# Altium project Cellar Watchdog.PrjPcb (part 2 of 4)

## Sheet CPU Clock.SchDoc: CPU Clock
size A4; Date: Dec. 27th, 2022; Author: Karl Asseily; DrawnBy: Karl Asseily; DocumentNumber: 202301222126; Revision: 1.2; SheetNumber: 12; SheetTotal: 20
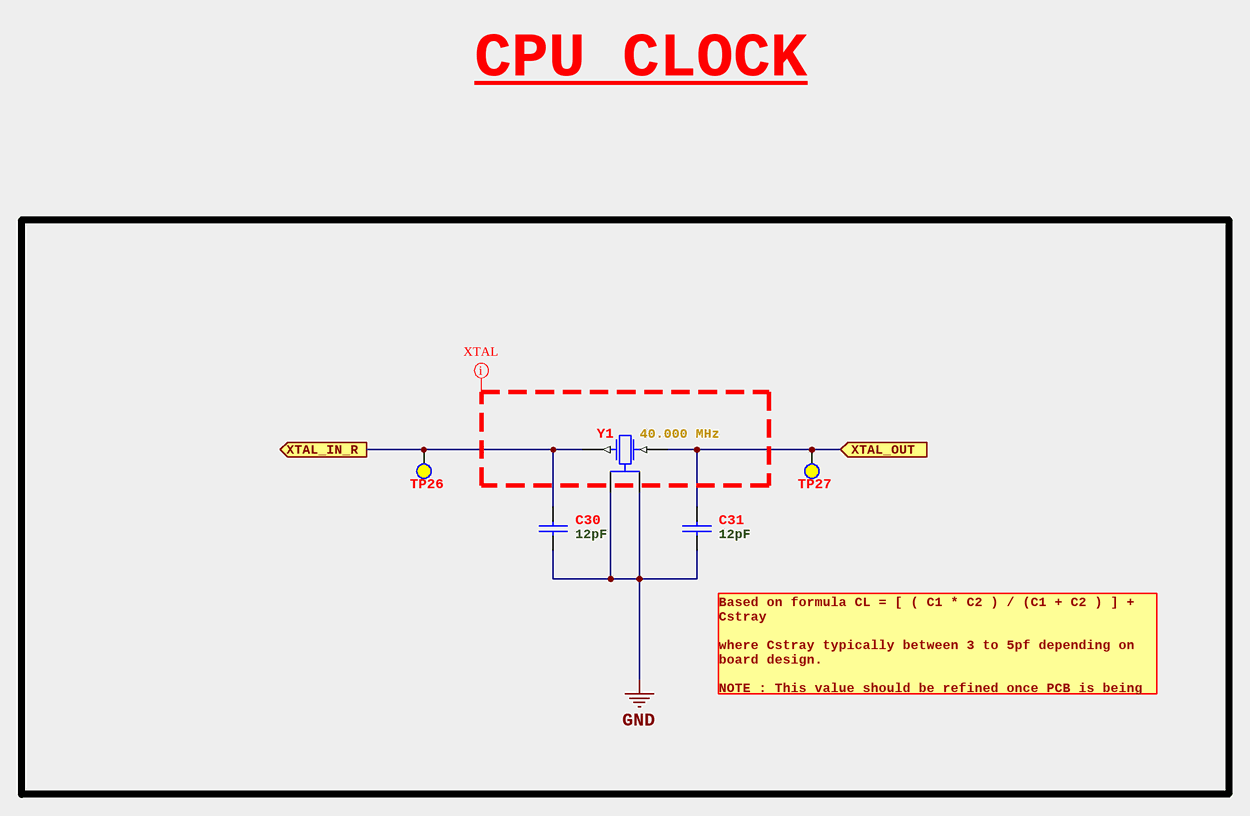
[diagram p6: CPU Clock.SchDoc]

### Parts
C30  12pF  [CAP_0603]
C31  12pF  [CAP_0603]
TP26  CPU 40MHz IN  [TEST POINT HOLE]  (value not drawn)  (no BOM)
TP27  CPU 40MHz OUT  [TEST POINT HOLE]  (value not drawn)  (no BOM)
Y1  Frequency: 40.000 MHz  [XTAL_ECS-400-10-37B2]  (hidden comment: ECS-400-10-37B2-CKY-TR)

### Ports
XTAL_IN_R (out, see Main Controller Unit, ESP32 Processor), XTAL_OUT (in, see Main Controller Unit, ESP32 Processor)

### Nets
GND: C30.2 C31.2 Y1.2(GND) Y1.4(GND)
XTAL_IN_R: C30.1 TP26.TP Y1.1(In/Out) ; port XTAL_IN_R
XTAL_OUT: C31.1 TP27.TP Y1.3(Out/In) ; port XTAL_OUT

### Layout directives
net class XTAL; rule Maximum Via Count Constraint [Max Count = 0]: (no net found under the mark)

### Notes on the sheet
- CPU CLOCK
- Based on formula CL = [ ( C1 * C2 ) / (C1 + C2 ) ] + Cstray
  where Cstray typically between 3 to 5pf depending on board design.
  NOTE : This value should be refined once PCB is being designed
- Project
- Sheet
- Size
- Filename
- A4
- of
- Number
- Drawn By
- Rev.
- Variant
- Date

### Library data of the parts
C30 C31 = CAP_12pf-50V-5%_0603: 12 pF ±5% 50V Ceramic Capacitor C0G, NP0 0603 (1608 Metric); Manufacturer: Yageo; Manufacturer Part Number: CC0603JRNPO9BN120; Insulation Resistance: 100GR; Supplier 1: Digi-Key; RoHS: Yes; Category: Ceramic Capacitors; Stock 1: 152407; Pricing 1: 1=0.10000, 10=0.05100, 50=0.02800, 100=0.02280, 500=0.01630, 1000=0.01280 (USD); Mounting Technology: Surface Mount; Case/Package: 0603; Pins: 2; Case Code (Metric): 1608; Case Code (Imperial): 0603; Dielectric Material: Ceramic; Min Operating Temperature: -55°C; Max Operating Temperature: 125°C; Package Quantity: 1; Capacitance: 12pF; Voltage Rating: 50V; Tolerance: 5%; Packaging: Tape and Reel; Voltage Rating (DC): 50V; Dielectric: C0G; Termination: SMD/SMT; Resistor Type: Ceramic; Series: CC; Length: 1.6mm; Width: 0.031inch; Height: 0.8mm; Thickness: 0.035inch; Depth: 0.8mm; Radiation Hardening: No; Reach SVHC Compliant: Yes; Lead Free: Lead Free; RoHS Compliant: Yes; ComponentLink7URL: C:\Users\Public\Documents\Altium\Projects\Cellar_Watchdog\Docs\Capacitor\UPY-GP_NP0_16V-to-50V_18.pdf; ComponentLink7Description: Datasheet; Supplier 2: Mouser; Supplier Part Number 1: 311-1059-1-ND; Supplier Part Number 2: 603-CC603JRNPO9BN120
TP26 TP27 = Test Point: PCB Test Point; ClassName: Test Point
  TP26: Value: CPU 40MHz IN
  TP27: Value: CPU 40MHz OUT
Y1 = XTAL_40.000MHz-10pF_4-SMD: 40 MHz ±10ppm Crystal 10pF 40 Ohms 4-SMD, No Lead; Manufacturer: ECS International; Supplier 1: Digi-Key; Manufacturer Part Number: ECS-400-10-37B2-CKY-TR; RoHS: No; Category: Uncategorized; Stock 1: 33639; Pricing 1: 1=0.45000, 10=0.37900, 50=0.34080, 100=0.30300, 500=0.28784, 1000=0.24240 (USD); Supplier 2: Mouser; Supplier Part Number 2: 520-400-10-37B2CKYTR; Supplier Part Number 1: 50-ECS-400-10-37B2-CKY-TRCT-ND; ComponentLink1Description: Datasheet; ComponentLink1URL: C:\Users\Public\Documents\Altium\Projects\Cellar_Watchdog\Docs\Crystal\ECX-1637B2.pdf

## Sheet RTC Clock.SchDoc: RTC Clock
size A4; Date: Dec. 27th, 2022; Author: Karl Asseily; DrawnBy: Karl Asseily; DocumentNumber: 202301140903; Revision: 1.2; SheetNumber: 16; SheetTotal: 20
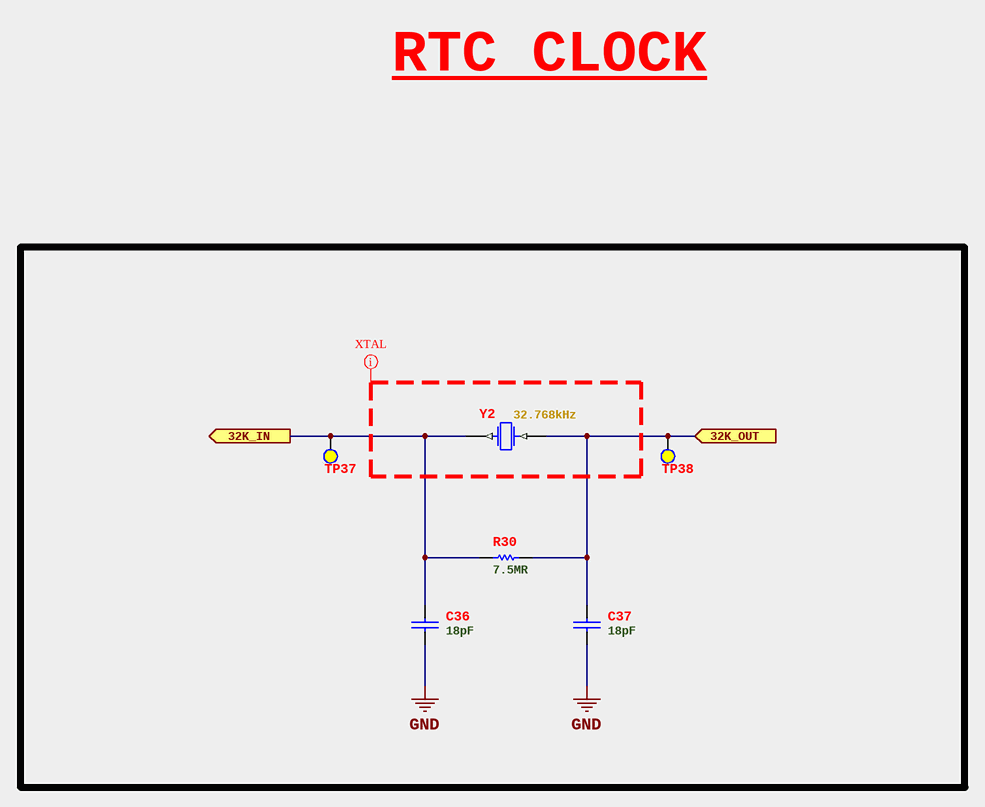
[diagram p7: RTC Clock.SchDoc]

### Parts
C36  18pF  [CAP_0603]
C37  18pF  [CAP_0603]
R30  7.5MR  [RES_0603]
TP37  RTC 32.768KHz IN  [TEST POINT HOLE]  (value not drawn)  (no BOM)
TP38  RTC 32.768KHz OUT  [TEST POINT HOLE]  (value not drawn)  (no BOM)
Y2  Frequency: 32.768kHz  [XTAL_ECX-.327-CDX-1293]  (hidden comment: ECX-.327-CDX-1293)

### Ports
32K_IN (out, see Main Controller Unit, ESP32 Processor), 32K_OUT (in, see Main Controller Unit, ESP32 Processor)

### Nets
GND: C36.2 C37.2
32K_IN: C36.1 R30.1 TP37.TP Y2.1(In/Out) ; port 32K_IN
32K_OUT: C37.1 R30.2 TP38.TP Y2.2(Out/In) ; port 32K_OUT

### Layout directives
net class XTAL; rule Maximum Via Count Constraint [Max Count = 0]: (no net found under the mark)

### Notes on the sheet
- RTC CLOCK
- Project
- Sheet
- Size
- Filename
- A4
- of
- Number
- Drawn By
- Rev.
- Variant
- Date

### Library data of the parts
C36 C37 = CAP_18pf-50V-1%_0603: 18 pF ±1% 50V Ceramic Capacitor C0G, NP0 0603 (1608 Metric); Manufacturer: Yageo; Manufacturer Part Number: CC0603FRNPO9BN180; Supplier 1: Digi-Key; RoHS: Yes; Category: Ceramic Capacitors; Stock 1: 77143; Pricing 1: 1=0.19000, 10=0.13300, 50=0.07560, 100=0.06260, 500=0.04390, 1000=0.03634 (USD); Mounting Technology: Surface Mount; Case/Package: 0603; Case Code (Imperial): 0603; Case Code (Metric): 1608; Min Operating Temperature: -55°C; Max Operating Temperature: 125°C; Tolerance: 1%; Capacitance: 18pF; Dielectric: C0G; Packaging: Tape and Reel; Voltage Rating: 50V; Voltage Rating (DC): 50V; Termination: SMD/SMT; Resistor Type: Ceramic; Series: CC; Length: 1.6mm; Width: 0.031inch; Height: 0.8mm; Thickness: 0.035inch; Depth: 0.8mm; Radiation Hardening: No; Lead Free: Lead Free; RoHS Compliant: Yes; Supplier 2: Mouser; ComponentLink1Description: Datasheet; ComponentLink1URL: C:\Users\Public\Documents\Altium\Projects\Cellar_Watchdog\Docs\Capacitor\UPY-GP_NP0_16V-to-50V_18.pdf; Supplier Part Number 2: 603-CC603FRNPO9BN180; Supplier Part Number 1: 311-3889-1-ND
R30 = RES_7.5MR-100mW-1%_0603: 7.5 MOhms ±1% 0.1W, 1/10W Chip Resistor 0603 (1608 Metric) Moisture Resistant Thick Film; Manufacturer: Yageo; Manufacturer Part Number: RC0603FR-077M5L; Temperature Coefficient: 100ppm/°C; Power Rating: 100mW; Voltage Rating: 50V; Supplier 1: Digi-Key; RoHS: Yes; Category: Chip SMD Resistors; Stock 1: 22856; Pricing 1: 1=0.10000, 10=0.02100, 100=0.00850, 1000=0.00383, 2500=0.00332 (USD); Case/Package: 0603; Contact Plating: Tin,Matte; Case Code (Imperial): 0603; Case Code (Metric): 1608; Min Operating Temperature: -55°C; Max Operating Temperature: 155°C; Resistance: 7.5MR; Tolerance: 1%; Resistor Type: Thick Film; Packaging: Tape and Reel; Termination: SMD/SMT; Number of Terminations: 2; Max Power Dissipation: 100mW; Features: Moisture Resistant; Series: RC; Construction: Rectangular; Length: 1.6mm; Width: 0.8mm; Height: 0.022inch; Depth: 0.8mm; Military Standard: Not; Lead Free: Lead Free; RoHS Compliant: Yes; ComponentLink1URL: C:\Users\Public\Documents\Altium\Projects\Cellar_Watchdog\Docs\Resistor\PYu-RC_Group_51_RoHS_L_12.pdf; ComponentLink1Description: Datasheet; Supplier 2: Mouser; Supplier Part Number 2: 603-RC0603FR-077M5L; Supplier Part Number 1: 13-RC0603FR-077M5LCT-ND
TP37 TP38 = Test Point: PCB Test Point; ClassName: Test Point
  TP37: Value: RTC 32.768KHz IN
  TP38: Value: RTC 32.768KHz OUT
Y2 = XTAL_32.768KHz-12.5pF_2-SMD: 32.768 kHz ±5ppm Crystal 12.5pF 70 kOhms 2-SMD, No Lead; Manufacturer: ECS International; ESR (Equivalent Series Resistance): 70kR; Supplier 1: Digi-Key; Manufacturer Part Number: ECX-.327-CDX-1293; RoHS: Yes; Category: Crystals; Stock 1: 208118; Pricing 1: 1=0.81000, 10=0.72000, 50=0.67320, 100=0.59490, 500=0.56358, 1000=0.46965 (USD); Mount: Surface Mount; Case/Package: SMD/SMT; Min Operating Temperature: -40°C; Max Operating Temperature: 85°C; Packaging: Tape and Reel; Frequency Tolerance: 5ppm; Load Capacitance: 12.5pF; RoHS Compliant: Yes; ComponentLink1URL: C:\Users\Public\Documents\Altium\Projects\Cellar_Watchdog\Docs\Crystal\ECX-.327-CDX-1293.pdf; ComponentLink1Description: Datasheet; Supplier 2: Mouser; Supplier Part Number 2: 520-ECX-.327CDX-1293; Supplier Part Number 1: XC2292CT-ND

## Sheet Voltage Supervisor.SchDoc: Voltage Supervisor
size A4; Date: Dec. 27th, 2022; Author: Karl Asseily; DrawnBy: Karl Asseily; DocumentNumber: 202301140903; Revision: 1.2; SheetNumber: 14; SheetTotal: 20
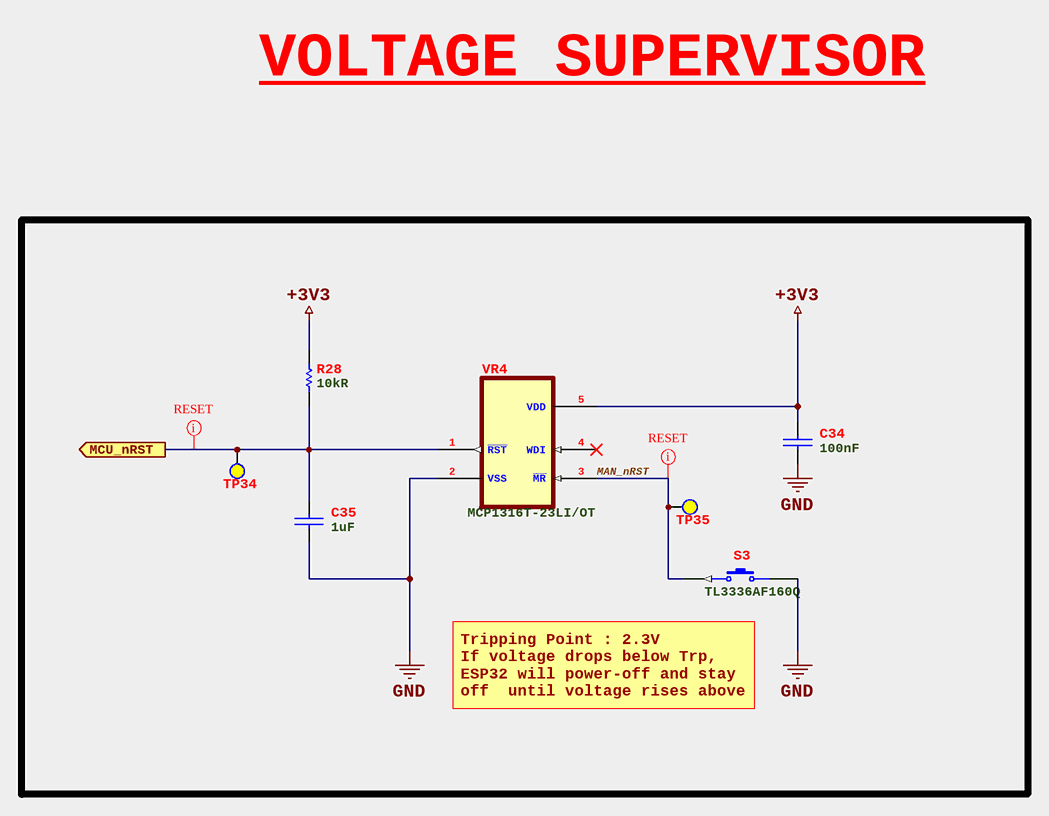
[diagram p8: Voltage Supervisor.SchDoc]

### Parts
C34  100nF  [CAP_0603]
C35  1uF  [CAP_0805]
R28  10kR  [RES_0603]
S3  TL3336AF160Q  [SW-TACTILE-SPST_TL3336]
TP34  MCU_nRST  [TEST POINT HOLE]  (value not drawn)  (no BOM)
TP35  MAN_nRST  [TEST POINT HOLE]  (value not drawn)  (no BOM)
VR4  MCP1316T-23LI/OT  [REG_SOT95P280X145-5N]

### Ports
MCU_nRST (out, see Main Controller Unit, ESP32 Processor)

### Nets
+3V3: C34.1 R28.2 VR4.5(VDD)
GND: C34.2 C35.2 S3.2 VR4.2(VSS)
MAN_nRST: S3.1 TP35.TP VR4.3(~{MR})
MCU_nRST: C35.1 R28.1 TP34.TP VR4.1(~{RST}) ; port MCU_nRST

Not connected (* = marked no-connect by the designer): VR4 4(WDI)*

### Layout directives
net class RESET: MAN_nRST, MCU_nRST

### Notes on the sheet
- VOLTAGE SUPERVISOR
- (near S3) Tripping Point : 2.3V
  If voltage drops below Trp, ESP32 will power-off and stay off  until voltage rises above 2.3V.
- Project
- Sheet
- Size
- Filename
- A4
- of
- Number
- Drawn By
- Rev.
- Variant
- Date

### Library data of the parts
C34 = CAP_0.1uF-50V-10%_0603: 0.1 µF ±10% 50V Ceramic Capacitor X7R 0603 (1608 Metric); Manufacturer: Yageo; Manufacturer Part Number: CC0603KRX7R9BB104; Supplier 1: Digi-Key; RoHS: Yes; Category: Ceramic Capacitors; Stock 1: 10054527; Pricing 1: 1=0.10000, 10=0.05400, 50=0.02960, 100=0.02430, 500=0.01732, 1000=0.01361 (USD); Mounting Technology: Surface Mount; Case/Package: 0603; Pins: 2; Case Code (Metric): 1608; Case Code (Imperial): 0603; Dielectric Material: Ceramic; Min Operating Temperature: -55°C; Max Operating Temperature: 125°C; Package Quantity: 1; Capacitance: 100nF; Voltage Rating: 50V; Tolerance: 10%; Packaging: Tape and Reel; Dielectric: X7R; Termination: SMD/SMT; Voltage: 50V; Series: CC; Length: 0.063inch; Width: 0.031inch; Height: 0.8mm; Thickness: 0.035inch; Depth: 0.8mm; Radiation Hardening: No; Reach SVHC Compliant: Yes; Lead Free: Lead Free; Halogen Free: Halogen Free; RoHS Compliant: Yes; ComponentLink1URL: C:\Users\Public\Documents\Altium\Projects\Cellar_Watchdog\Docs\Capacitor\UPY-GPHC_X7R_6.3V-to-250V_22.pdf; ComponentLink1Description: Datasheet; Supplier Part Number 2: 603-CC603KRX7R9BB104; Supplier Part Number 1: 311-1344-1-ND; Supplier 2: Mouser
C35 = CAP_1uF-16V-10%_0603: 1 µF ±10% 16V Ceramic Capacitor X7R 0603 (1608 Metric); Manufacturer: Yageo; Manufacturer Part Number: CC0603KRX7R7BB105; Dissipation Factor: 5%; Supplier 1: Digi-Key; RoHS: Yes; Category: Ceramic Capacitors; Stock 1: 10491943; Pricing 1: 1=0.14000, 10=0.09800, 50=0.05560, 100=0.04610, 500=0.03234, 1000=0.02678 (USD); Mounting Technology: Surface Mount; Case/Package: 0603; Pins: 2; Case Code (Metric): 1608; Case Code (Imperial): 0603; Min Operating Temperature: -55°C; Max Operating Temperature: 125°C; Capacitance: 1uF; Tolerance: 10%; Dielectric: X7R; Voltage Rating: 16V; Package Quantity: 1; Packaging: Tape and Reel; Voltage Rating (DC): 16V; Termination: SMD/SMT; Resistor Type: Ceramic; Voltage: 16V; Series: CC; Construction: Flat; Length: 1.6mm; Width: 0.031inch; Height: 0.8mm; Thickness: 0.035inch; Depth: 0.8mm; Radiation Hardening: No; Lead Free: Lead Free; Halogen Free: Halogen Free; RoHS Compliant: Yes; ComponentLink1URL: C:\Users\Public\Documents\Altium\Projects\Cellar_Watchdog\Docs\Capacitor\UPY-GPHC_X7R_6.3V-to-250V_22.pdf; ComponentLink1Description: Datasheet; Supplier 2: Mouser; Supplier Part Number 1: 311-1446-1-ND; Supplier Part Number 2: 603-CC603KRX7R7BB105
R28 = RES_10kR-100mW-1%_0603: 10 kOhms ±1% 0.1W, 1/10W Chip Resistor 0603 (1608 Metric) Moisture Resistant Thick Film; Manufacturer: Yageo; Manufacturer Part Number: RC0603FR-0710KL; Temperature Coefficient: 100ppm/°C; Voltage Rating (DC): 50V; Power Rating: 100mW; Voltage Rating: 75V; Supplier 1: Digi-Key; RoHS: Yes; Category: Chip SMD Resistors; Stock 1: 43209622; Pricing 1: 1=0.10000, 10=0.02100, 100=0.00850, 1000=0.00383, 2500=0.00332 (USD); Case/Package: 0603; Pins: 2; Case Code (Imperial): 0603; Case Code (Metric): 1608; Weight: 7.1E-05oz; Min Operating Temperature: -55°C; Max Operating Temperature: 155°C; Tolerance: 1%; Resistor Type: Thick Film; Resistance: 10kR; Packaging: Tape and Reel; Termination: SMD/SMT; Features: Moisture Resistant; Series: RC; Max Power Dissipation: 100mW; Number of Terminations: 2; Resistance Tolerance: 1%; Construction: Rectangular; Length: 1.6mm; Width: 0.8mm; Height: 0.45mm; Depth: 0.8mm; Lead Pitch: 0.3mm; Reach SVHC Compliant: Yes; Lead Free: Lead Free; Military Standard: Not; RoHS Compliant: Yes; ComponentLink6URL: C:\Users\Public\Documents\Altium\Projects\Cellar_Watchdog\Docs\Resistor\PYu-RC_Group_51_RoHS_L_12.pdf; ComponentLink6Description: Datasheet; Supplier 2: Mouser; Supplier Part Number 1: 311-10.0KHRCT-ND; Supplier Part Number 2: 603-RC0603FR-0710KL
S3 = SW2-NO-SPST_TL3336AF160Q_SMD: Tactile Switch SPST-NO Side Actuated Surface Mount, Right Angle; Manufacturer: E-Switch; Supplier 1: Digi-Key; Manufacturer Part Number: TL3336AF160Q; RoHS: No; Category: Tactile Switches; Stock 1: 16874; Pricing 1: 1=0.49000, 10=0.47200, 25=0.45440, 100=0.39310, 250=0.35820 (USD); Supplier 2: Mouser; Supplier Part Number 1: 141-TL3336AF160QCT-ND; Supplier Part Number 2: 612-TL3336AF160Q; ComponentLink1Description: Datasheet; ComponentLink1URL: C:\Users\Public\Documents\Altium\Projects\Cellar_Watchdog\Docs\Switch\TL3336.pdf
TP34 TP35 = Test Point: PCB Test Point; ClassName: Test Point
  TP34: Value: MCU_nRST
  TP35: Value: MAN_nRST
VR4 = SUP_2.3V-ActiveLow-140ms_SOT23-5: Supervisor Push-Pull, Totem Pole 1 Channel SOT-23-5; Manufacturer: Microchip; Number of Voltages Monitored: 1; Reset Timeout: 140ms; Threshold Voltage: 2.3V; Supplier 1: Digi-Key; Manufacturer Part Number: MCP1316T-23LI/OT; RoHS: Yes; Category: Voltage Supervisors; Stock 1: 1812; Pricing 1: 1=0.86000, 25=0.76480 (USD); Mounting Technology: Surface Mount; Case/Package: SOT-23-5; Min Operating Temperature: -40°C; Max Operating Temperature: 85°C; Type: Simple Reset/Power-On Reset; Reset: Active Low; Packaging: Cut Tape; RoHS Compliant: Yes; ComponentLink1URL: C:\Users\Public\Documents\Altium\Projects\Cellar_Watchdog\Docs\IC Supervisor\MCP131X-2X-Voltage-Supervisor-DS20001985E.pdf; ComponentLink1Description: Datasheet; Supplier 2: Mouser; Supplier Part Number 1: MCP1316T-23LI/OTCT-ND; Supplier Part Number 2: 579-MCP1316T-23LI/OT

## Sheet USB-to-Serial Converter.SchDoc: USB to Serial Converter
size A4; Date: Dec. 28th, 2022; Author: Karl Asseily; DrawnBy: Karl Asseily; DocumentNumber: 202301140903; Revision: 1.2; SheetNumber: 9; SheetTotal: 20; Time: 10:23
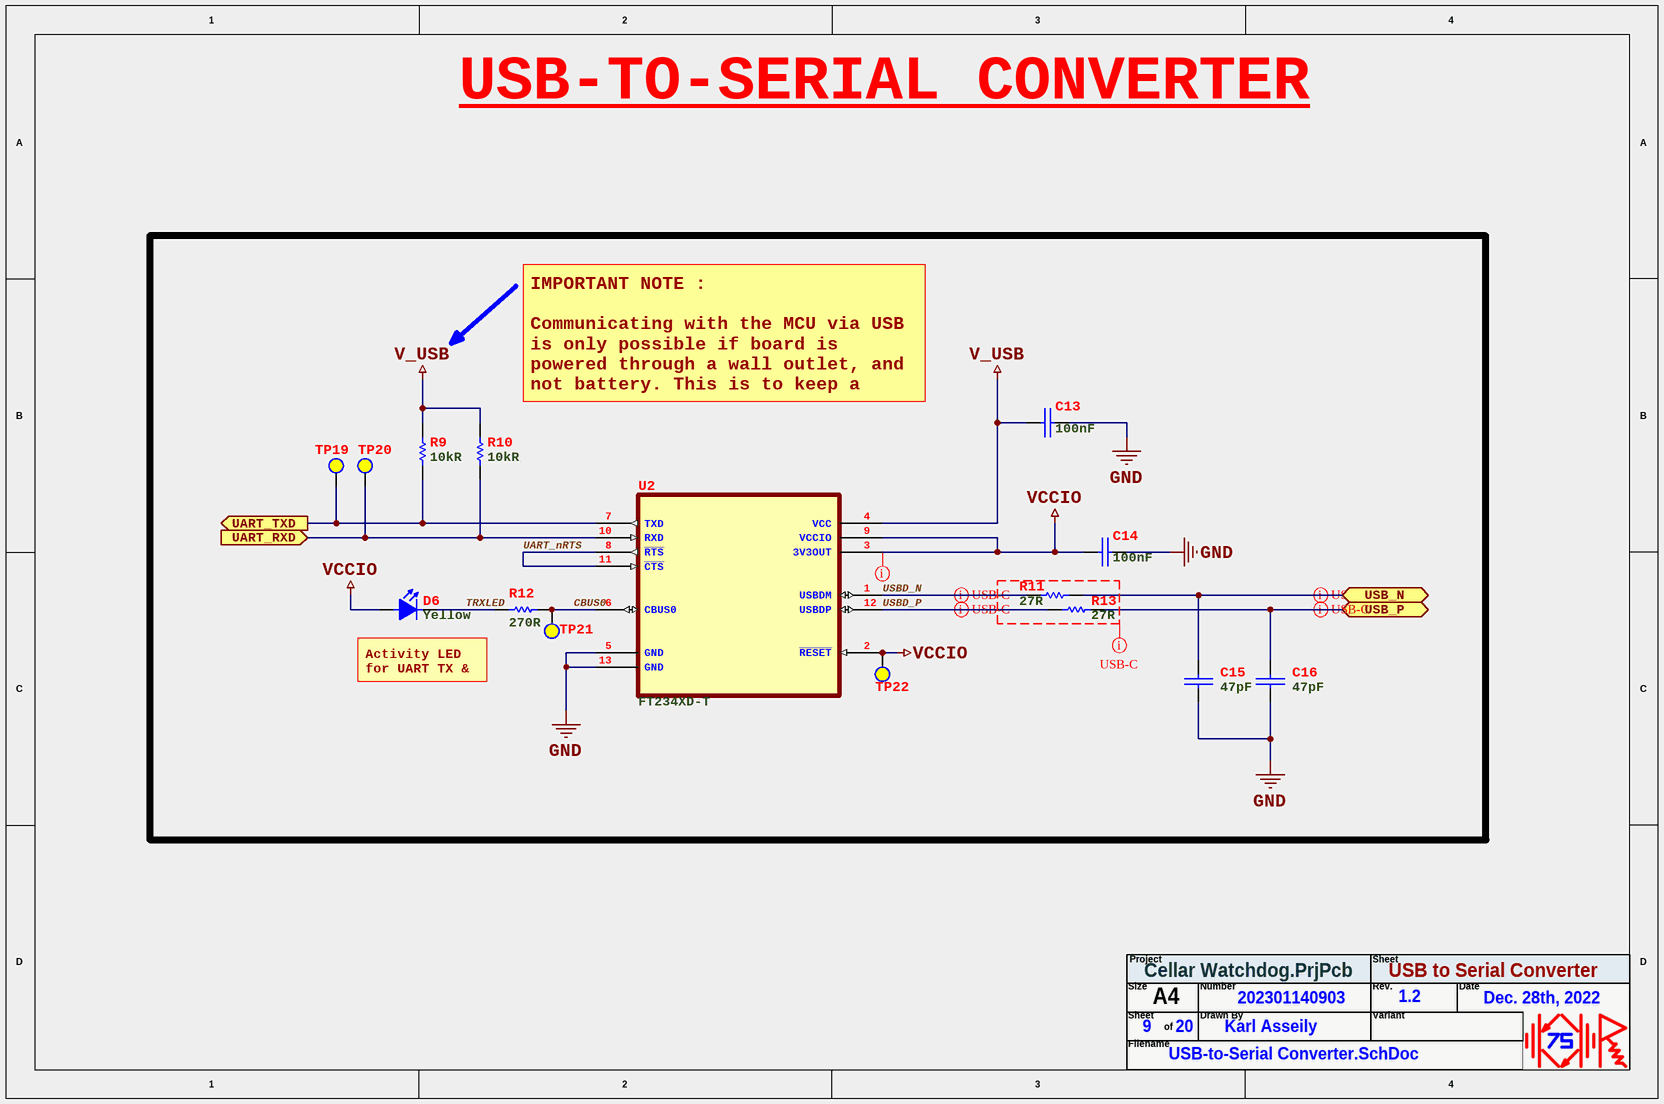
[diagram p9: USB-to-Serial Converter.SchDoc]

### Parts
C13  100nF  [CAP_0603]
C14  100nF  [CAP_0603]
C15  47pF  [CAP_0603]
C16  47pF  [CAP_0603]
D6  Yellow  [LED_YLW_0603]
R9  10kR  [RES_0603]
R10  10kR  [RES_0603]
R11  27R  [RES_0603]
R12  270R  [RES_0603]
R13  27R  [RES_0603]
TP19  UART_TXD  [TEST POINT HOLE]  (value not drawn)  (no BOM)
TP20  UART_RXD  [TEST POINT HOLE]  (value not drawn)  (no BOM)
TP21  CBUS0  [TEST POINT HOLE]  (value not drawn)  (no BOM)
TP22  VCCIO  [TEST POINT HOLE]  (value not drawn)  (no BOM)
U2  FT234XD-T  [IC_SON45P300X300X80-13N]

### Ports
UART_RXD (in, see Cellar Watchdog, ESP32 Processor, Main Controller Unit), UART_TXD (out, see Cellar Watchdog, ESP32 Processor, Main Controller Unit), USB_N (bidir, see Cellar Watchdog, Power Delivery, USB-C Connector), USB_P (bidir, see Cellar Watchdog, Power Delivery, USB-C Connector)

### Nets
GND: C13.2 C14.2 C15.2 C16.2 U2.5(GND) U2.13(GND)
V_USB: C13.1 R9.2 R10.2 U2.4(VCC)
VCCIO: C14.1 D6.1(A) TP22.TP U2.2(~{RESET}) U2.3(3V3OUT) U2.9(VCCIO)
CBUS0: R12.2 TP21.TP U2.6(CBUS0)
TRXLED: D6.2(K) R12.1
UART_nRTS: U2.8(~{RTS}) U2.11(~{CTS})
UART_RXD: R10.1 TP20.TP U2.10(RXD) ; port UART_RXD
UART_TXD: R9.1 TP19.TP U2.7(TXD) ; port UART_TXD
USB_N: C15.1 R11.2 ; port USB_N
USB_P: C16.1 R13.2 ; port USB_P
USBD_N: R11.1 U2.1(USBDM)
USBD_P: R13.1 U2.12(USBDP)

### Layout directives
net class USB-C; rule Impedance Constraint [Min = 89.10    Max = 90.90    ]; rule Matched Net Lengths [Delay Tolerance = 5ps]; rule Length Constraint [Min Length = 0mil    Max Length = 3000mil]: (no net found under the mark)
differential pair; differential pair class USB: USB_N, USB_P, USBD_N, USBD_P
net class POWER; rule Supply Nets [Voltage = 3.300]: VCCIO

### Notes on the sheet
- USB-TO-SERIAL CONVERTER
- (near R10) IMPORTANT NOTE :
  Communicating with the MCU via USB is only possible if board is powered through a wall outlet, and not battery. This is to keep a constant 5V supply to the IC.
- Activity LED for UART TX & RX
- Project
- Sheet
- Size
- Filename
- A4
- of
- Number
- Drawn By
- Rev.
- Variant
- Date

### Library data of the parts
C13 C14 = CAP_0.1uF-50V-10%_0603: as C34 on sheet Voltage Supervisor; Supplier 1: Digi-Key; RoHS: Yes; Category: Ceramic Capacitors; Stock 1: 10054527; Pricing 1: 1=0.10000, 10=0.05400, 50=0.02960, 100=0.02430, 500=0.01732, 1000=0.01361 (USD); Mounting Technology: Surface Mount; Case/Package: 0603; Pins: 2; Case Code (Metric): 1608; Case Code (Imperial): 0603; Dielectric Material: Ceramic; Min Operating Temperature: -55°C; Max Operating Temperature: 125°C; Package Quantity: 1; Capacitance: 100nF; Voltage Rating: 50V; Tolerance: 10%; Packaging: Tape and Reel; Dielectric: X7R; Termination: SMD/SMT; Voltage: 50V; Series: CC; Length: 0.063inch; Width: 0.031inch; Height: 0.8mm; Thickness: 0.035inch; Depth: 0.8mm; Radiation Hardening: No; Reach SVHC Compliant: Yes; Lead Free: Lead Free; Halogen Free: Halogen Free; RoHS Compliant: Yes; ComponentLink1URL: C:\Users\Public\Documents\Altium\Projects\Cellar_Watchdog\Docs\Capacitor\UPY-GPHC_X7R_6.3V-to-250V_22.pdf; ComponentLink1Description: Datasheet; Supplier Part Number 2: 603-CC603KRX7R9BB104; Supplier Part Number 1: 311-1344-1-ND; Supplier 2: Mouser
C15 C16 = CAP_47pf-50V-5%_0603: 47 pF ±5% 50V Ceramic Capacitor C0G, NP0 0603 (1608 Metric); Manufacturer: Yageo Phycomp; Manufacturer Part Number: CC0603JRNPO9BN470; Insulation Resistance: 100GR; Temperature Coefficient: 30ppm/°C; Supplier 1: Digi-Key; RoHS: Yes; Category: Ceramic Capacitors; Stock 1: 855841; Pricing 1: 1=0.10000, 10=0.03500, 50=0.01920, 100=0.01570, 500=0.01120, 1000=0.00880 (USD); Mounting Technology: Surface Mount; Case/Package: 0603; Pins: 2; Case Code (Imperial): 0603; Case Code (Metric): 1608; Min Operating Temperature: -55°C; Max Operating Temperature: 125°C; Tolerance: 5%; Capacitance: 47pF; Dielectric: C0G; Voltage Rating: 50V; Packaging: Tape and Reel; Voltage Rating (DC): 50V; Voltage: 50V; Package Quantity: 1; Termination: SMD/SMT; Resistor Type: Ceramic; Series: CC; Length: 1.6mm; Width: 0.8mm; Height: 0.8mm; Thickness: 0.035inch; Depth: 0.8mm; Radiation Hardening: No; Lead Free: Lead Free; RoHS Compliant: Yes; Reach SVHC Compliant: Yes; ComponentLink1URL: C:\Users\Public\Documents\Altium\Projects\Cellar_Watchdog\Docs\Capacitor\UPY-GP_NP0_16V-to-50V_18.pdf; ComponentLink1Description: Datasheet; Supplier 2: Mouser; Supplier Part Number 1: 311-1065-1-ND; Supplier Part Number 2: 603-CC603JRNPO9BN470
D6 = LED_YLW-2.1V-30mA_0603: Yellow 591nm LED Indication - Discrete 2.1V 0603 (1608 Metric); Manufacturer: Vishay Lite-On; Manufacturer Part Number: LTST-C191KSKT; Lens Color: Colorless; Viewing Angle: 130°; Lens Style: Diffused,Colorless,Rectangular,Clear; Luminous Intensity: 180mcd; Forward Current: 30mA; Forward Voltage: 2.4V; Power Rating: 75mW; Dominant Wavelength: 597nm; Test Current: 20mA; Lens Transparency: Clear; Number of Elements: 1; Wavelength: 588nm; Reverse Voltage: 5V; Supplier 1: Digi-Key; RoHS: Yes; Category: LEDs; Stock 1: 1434021; Pricing 1: 1=0.28000, 10=0.15000, 100=0.06990, 500=0.06450, 1000=0.05052, 2000=0.04945 (USD); Mounting Technology: Surface Mount; Case/Package: 0603; Pins: 2; Color: Yellow; Case Code (Metric): 1608; Case Code (Imperial): 0603; Min Operating Temperature: -55°C; Max Operating Temperature: 85°C; Package Quantity: 1; Packaging: Tape and Reel; Illumination Color: Yellow; Power Dissipation: 75mW; Number of LEDs: 1; Length: 1.6mm; Width: 0.8mm; Height: 0.55mm; Depth: 0.8mm; Radiation Hardening: No; RoHS Compliant: Yes; Lead Free: Lead Free; ComponentLink1URL: C:\Users\Public\Documents\Altium\Projects\Cellar_Watchdog\Docs\LED\LTST-C191KSKT.PDF; ComponentLink1Description: Datasheet; Supplier 2: Mouser; Supplier Part Number 1: 160-1448-1-ND; Supplier Part Number 2: 859-LTST-C191KSKT
R9 R10 = RES_10kR-100mW-1%_0603: as R28 on sheet Voltage Supervisor; Supplier 1: Digi-Key; RoHS: Yes; Category: Chip SMD Resistors; Stock 1: 43209622; Pricing 1: 1=0.10000, 10=0.02100, 100=0.00850, 1000=0.00383, 2500=0.00332 (USD); Case/Package: 0603; Pins: 2; Case Code (Imperial): 0603; Case Code (Metric): 1608; Weight: 7.1E-05oz; Min Operating Temperature: -55°C; Max Operating Temperature: 155°C; Tolerance: 1%; Resistor Type: Thick Film; Resistance: 10kR; Packaging: Tape and Reel; Termination: SMD/SMT; Features: Moisture Resistant; Series: RC; Max Power Dissipation: 100mW; Number of Terminations: 2; Resistance Tolerance: 1%; Construction: Rectangular; Length: 1.6mm; Width: 0.8mm; Height: 0.45mm; Depth: 0.8mm; Lead Pitch: 0.3mm; Reach SVHC Compliant: Yes; Lead Free: Lead Free; Military Standard: Not; RoHS Compliant: Yes; ComponentLink6URL: C:\Users\Public\Documents\Altium\Projects\Cellar_Watchdog\Docs\Resistor\PYu-RC_Group_51_RoHS_L_12.pdf; ComponentLink6Description: Datasheet; Supplier 2: Mouser; Supplier Part Number 1: 311-10.0KHRCT-ND; Supplier Part Number 2: 603-RC0603FR-0710KL
R11 R13 = RES_27R-100mW-1%_0603: 27 Ohms ±1% 0.1W, 1/10W Chip Resistor 0603 (1608 Metric) Moisture Resistant Thick Film; Manufacturer: Yageo; Manufacturer Part Number: RC0603FR-0727RL; Voltage Rating (DC): 50V; Temperature Coefficient: 100ppm/°C; Power Rating: 100mW; Supplier 1: Digi-Key; RoHS: Yes; Category: Chip SMD Resistors; Stock 1: 815867; Pricing 1: 1=0.10000, 10=0.02100, 100=0.00850, 1000=0.00383, 2500=0.00332 (USD); Case/Package: 0603; Pins: 2; Case Code (Metric): 1608; Case Code (Imperial): 0603; Min Operating Temperature: -55°C; Max Operating Temperature: 155°C; Resistance: 27R; Tolerance: 1%; Packaging: Tape and Reel; Resistor Type: Thick Film; Number of Terminations: 2; Voltage Rating: 50V; Package Quantity: 1; Termination: SMD/SMT; Max Power Dissipation: 100mW; Features: Moisture Resistant; Series: RC; Resistance Tolerance: 1%; Length: 0.063inch; Width: 0.8mm; Height: 0.022inch; Depth: 0.8mm; Lead Free: Lead Free; RoHS Compliant: Yes; Supplier 2: Mouser; Supplier Part Number 1: 311-27.0HRCT-ND; Supplier Part Number 2: 603-RC0603FR-0727RL; ComponentLink1Description: Datasheet; ComponentLink1URL: C:\Users\Public\Documents\Altium\Projects\Cellar_Watchdog\Docs\Resistor\PYu-RC_Group_51_RoHS_L_12.pdf
R12 = RES_270R-100mW-1%_0603: 270 Ohms ±1% 0.1W, 1/10W Chip Resistor 0603 (1608 Metric) Moisture Resistant Thick Film; Manufacturer: Yageo; Manufacturer Part Number: RC0603FR-07270RL; Power Rating: 100mW; Voltage Rating: 50V; Temperature Coefficient: 100ppm/°C; Supplier 1: Digi-Key; RoHS: Yes; Category: Chip SMD Resistors; Stock 1: 697012; Pricing 1: 1=0.10000, 10=0.02100, 100=0.00850, 1000=0.00383, 2500=0.00332 (USD); Case/Package: 0603; Pins: 2; Case Code (Imperial): 0603; Case Code (Metric): 1608; Min Operating Temperature: -55°C; Max Operating Temperature: 155°C; Resistance: 270R; Tolerance: 1%; Packaging: Tape and Reel; Voltage Rating (DC): 50V; Package Quantity: 5000; Termination: SMD/SMT; Resistor Type: Thick Film; Number of Terminations: 2; Max Power Dissipation: 100mW; Features: Moisture Resistant; Series: RC; Resistance Tolerance: 1%; Technology: THICK FILM; Construction: Rectangular; Length: 0.063inch; Width: 0.031inch; Height: 0.022inch; Depth: 0.8mm; RoHS Compliant: Yes; Military Standard: Not; Lead Free: Lead Free; ComponentLink1URL: C:\Users\Public\Documents\Altium\Projects\Cellar_Watchdog\Docs\Resistor\PYu-RC_Group_51_RoHS_L_12.pdf; ComponentLink1Description: Datasheet; Supplier 2: Mouser; Supplier Part Number 2: 603-RC0603FR-07270RL; Supplier Part Number 1: 311-270HRCT-ND
TP19-TP22 = Test Point: PCB Test Point; ClassName: Test Point
  TP19: Value: UART_TXD
  TP20: Value: UART_RXD
  TP21: Value: CBUS0
  TP22: Value: VCCIO
U2 = IC_FT234XD-T: USB Bridge, USB to UART USB 2.0 UART Interface 12-DFN (3x3); Manufacturer: FTDI; Number of Channels: 1; Operating Supply Voltage: 5.25V; Max Supply Voltage: 5.5V; Min Supply Voltage: 2.97V; Interface: USB,UART; Data Rate: 480Mbps; Operating Supply Current: 8mA; Supplier 1: Digi-Key; Manufacturer Part Number: FT234XD-T; RoHS: Yes; Category: Uncategorized; Stock 1: 30920; Pricing 1: 1=2.26000, 25=2.19000, 100=2.12000, 250=1.93000, 500=1.76250 (USD); Mount: Surface Mount; Case/Package: DFN; Number of Pins: 12; Min Operating Temperature: -40°C; Max Operating Temperature: 85°C; Packaging: Tray; Package Quantity: 490; ComponentLink2URL: C:\Users\Public\Documents\Altium\Projects\Cellar_Watchdog\Docs\USB-Serial Converter\DS_FT234XD.pdf; ComponentLink2Description: Datasheet; Supplier 2: Mouser; Supplier Part Number 1: 768-1345-ND; Supplier Part Number 2: 895-FT234XD-T; ComponentLink3Description: Design Guide (FT232BM); ComponentLink3URL: C:\Users\Public\Documents\Altium\Projects\Cellar_Watchdog\Docs\USB-Serial Converter\DG232_20.pdf; ComponentLink4Description: Technical Note USB Type-C; ComponentLink4URL: C:\Users\Public\Documents\Altium\Projects\Cellar_Watchdog\Docs\USB-Serial Converter\TN_181-Type-C-USB-Connectors-with-FTDI-Products.pdf

## Sheet Power Delivery.SchDoc: Power Delivery
size A4; Date: Dec. 28th, 2022; Author: Karl Asseily; DrawnBy: Karl Asseily; DocumentNumber: 202301111111; Revision: 1.2; SheetNumber: 4; SheetTotal: 20; Time: 18:58
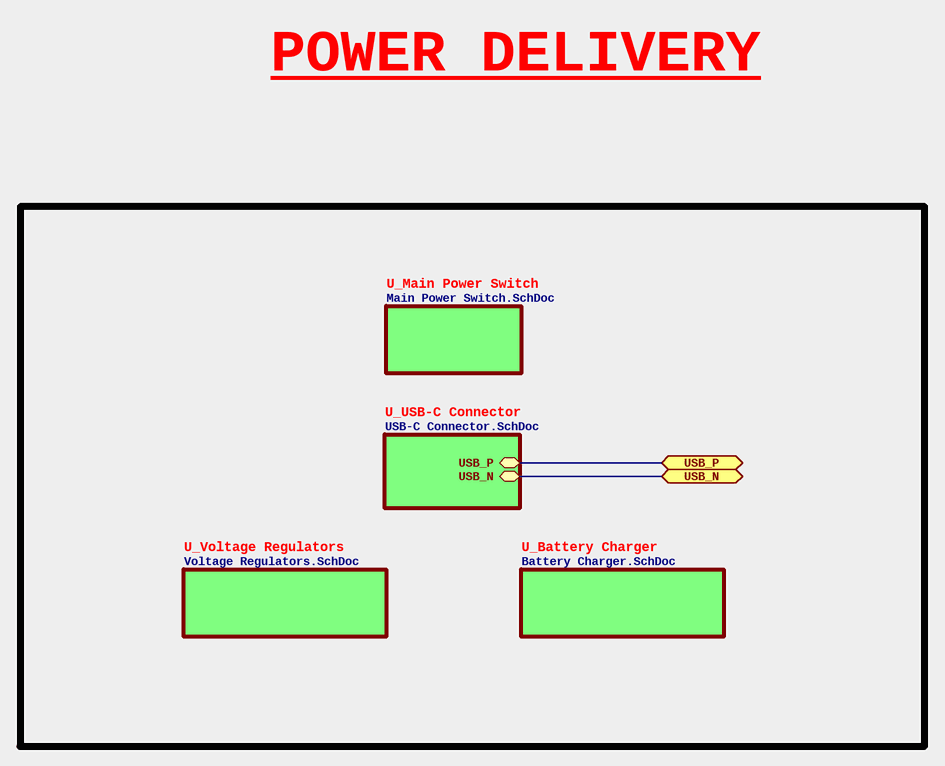
[diagram p10: Power Delivery.SchDoc]

### Sub-sheets
U_Battery Charger = Battery Charger.SchDoc: no entries
U_Main Power Switch = Main Power Switch.SchDoc: no entries
U_USB-C Connector = USB-C Connector.SchDoc: USB_N (bidir), USB_P (bidir)
U_Voltage Regulators = Voltage Regulators.SchDoc: no entries

### Ports
USB_N (bidir, see Cellar Watchdog, USB-C Connector, USB-to-Serial Converter), USB_P (bidir, see Cellar Watchdog, USB-C Connector, USB-to-Serial Converter)

### Nets
USB_N: port USB_N, sheet U_USB-C Connector/USB_N
USB_P: port USB_P, sheet U_USB-C Connector/USB_P

### Notes on the sheet
- POWER DELIVERY
- Project
- Sheet
- Size
- Filename
- A4
- of
- Number
- Drawn By
- Rev.
- Variant
- Date

## Sheet USB-C Connector.SchDoc: Main Connector
size A4; Date: Dec. 27th, 2022; Author: Karl Asseily; DrawnBy: Karl Asseily; DocumentNumber: 202301191218; Revision: 1.2; SheetNumber: 6; SheetTotal: 20
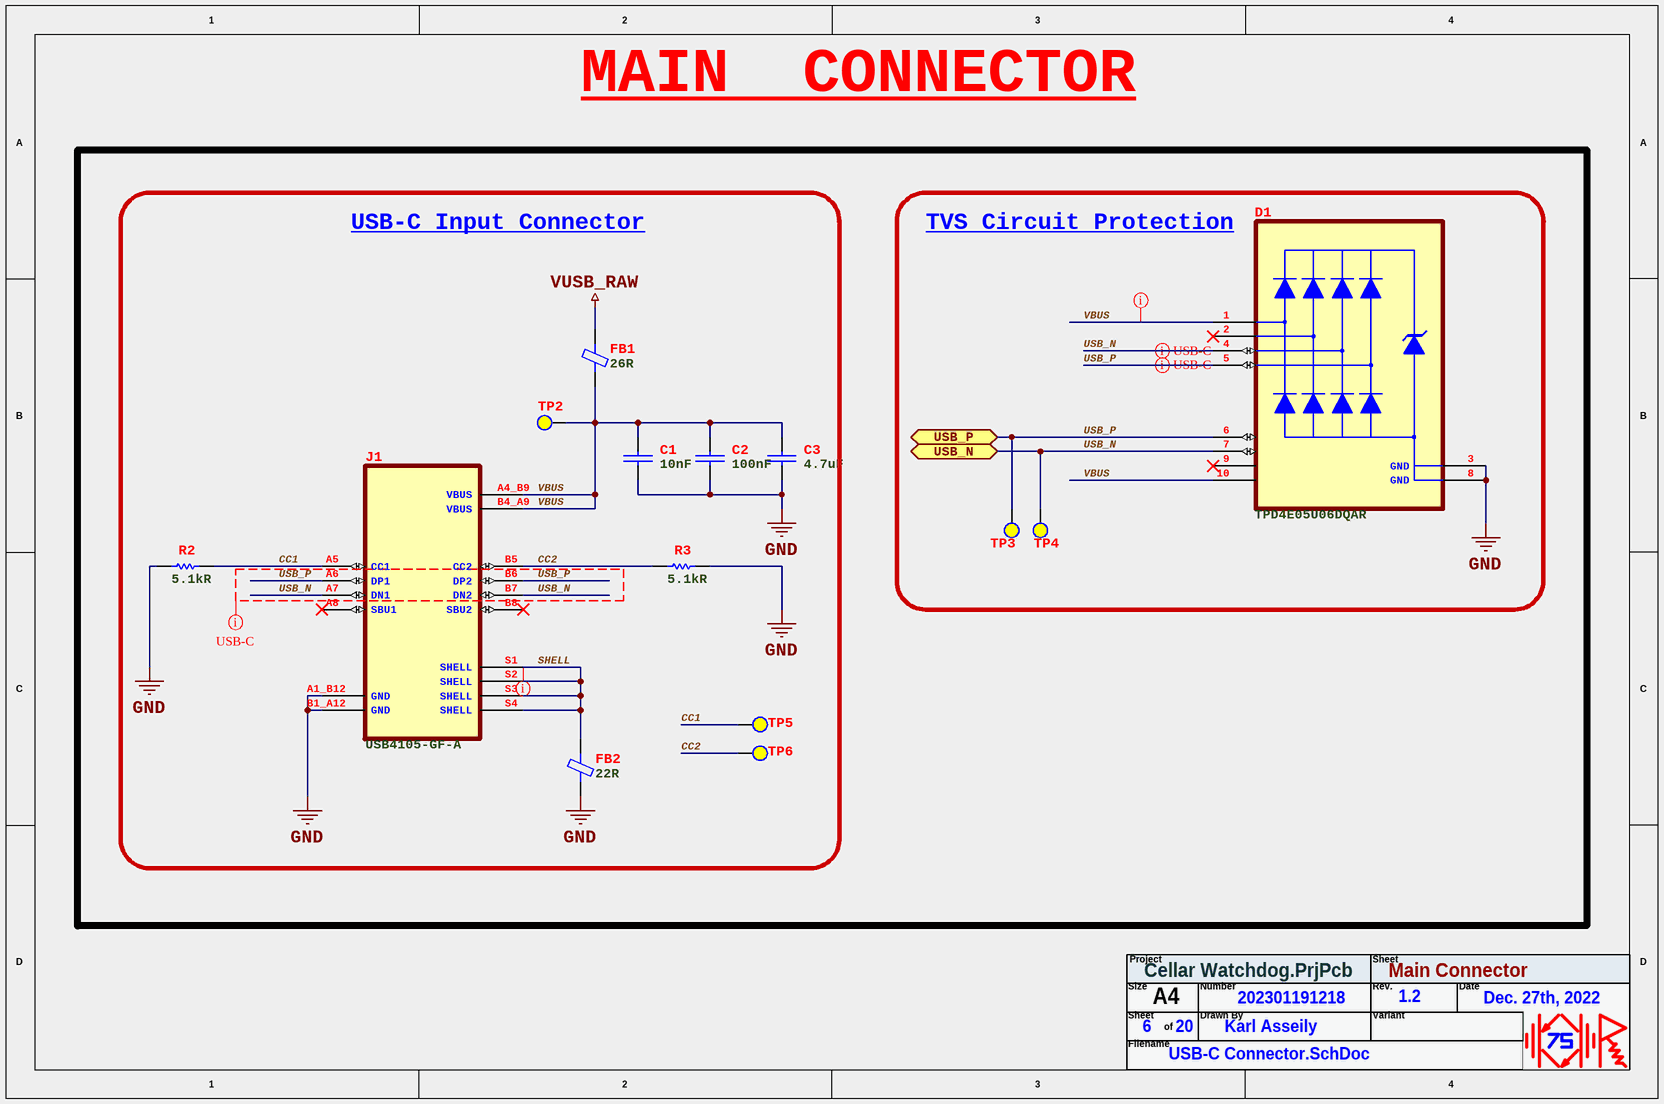
[diagram p11: USB-C Connector.SchDoc]

### Parts
C1  10nF  [CAP_0603]
C2  100nF  [CAP_0603]
C3  4.7uF  [CAP_0805]
D1  TPD4E05U06DQAR  [DIO-T-A_10-USON]
FB1  26R  [FB_0603]
FB2  22R  [FB_0603]
J1  USB4105-GF-A  [CON-RCPT_USB2.0-Type-C_GCT_USB4105-GF-A]
R2  5.1kR  [RES_0603]
R3  5.1kR  [RES_0603]
TP2  VBUS  [TEST POINT HOLE]  (value not drawn)  (no BOM)
TP3  USB_P  [TEST POINT PAD]  (value not drawn)  (no BOM)
TP4  USB_N  [TEST POINT PAD]  (value not drawn)  (no BOM)
TP5  CC1  [TEST POINT PAD]  (value not drawn)  (no BOM)
TP6  CC2  [TEST POINT PAD]  (value not drawn)  (no BOM)

### Blocks framed on the sheet
USB-C Input Connector: C1-C3 FB1 FB2 J1 R2 R3 TP2 TP5 TP6
TVS Circuit Protection: D1 TP3 TP4

### Ports
USB_N (bidir, see Power Delivery, USB-to-Serial Converter), USB_P (bidir, see Power Delivery, USB-to-Serial Converter)

### Nets
GND: C1.2 C2.2 C3.2 D1.3(GND) D1.8(GND) FB2.2 J1.A1_B12(GND) J1.B1_A12(GND) R2.2 R3.2
VUSB_RAW: FB1.2
CC1: J1.A5(CC1) R2.1 TP5.TP
CC2: J1.B5(CC2) R3.1 TP6.TP
SHELL: FB2.1 J1.S1(SHELL) J1.S2(SHELL) J1.S3(SHELL) J1.S4(SHELL)
USB_N: D1.4(D2+) D1.7(NC) J1.A7(DN1) J1.B7(DN2) TP4.TP ; port USB_N
USB_P: D1.5(D2-) D1.6(NC) J1.A6(DP1) J1.B6(DP2) TP3.TP ; port USB_P
VBUS: C1.1 C2.1 C3.1 D1.1(D1+) D1.10(NC) FB1.1 J1.A4_B9(VBUS) J1.B4_A9(VBUS) TP2.TP

Not connected (* = marked no-connect by the designer): D1 2(D1-)* 9(NC)*; J1 A8(SBU1)* B8(SBU2)*

### Layout directives
net class POWER; rule Supply Nets [Voltage = 0.000]: SHELL
differential pair; differential pair class USB: USB_N, USB_P
net class USB-C; rule Impedance Constraint [Min = 89.10    Max = 90.90    ]; rule Matched Net Lengths [Delay Tolerance = 5ps]; rule Length Constraint [Min Length = 0mil    Max Length = 1000mil]: USB_N, USB_P
net class POWER; rule Supply Nets [Voltage = 5.000]: VBUS

### Notes on the sheet
- MAIN  CONNECTOR
- Project
- Sheet
- Size
- Filename
- A4
- of
- Number
- Drawn By
- Rev.
- Variant
- Date

### Library data of the parts
C1 = CAP_10nF-50V-10%_0603: 10000 pF ±10% 50V Ceramic Capacitor X7R 0603 (1608 Metric); Manufacturer: Yageo; Manufacturer Part Number: CC0603KRX7R9BB103; Insulation Resistance: 100GR; Supplier 1: Digi-Key; RoHS: Yes; Category: Ceramic Capacitors; Stock 1: 8015125; Pricing 1: 1=0.10000, 10=0.03200, 50=0.01760, 100=0.01440, 500=0.01026, 1000=0.00805 (USD); Mounting Technology: Surface Mount; Case/Package: 0603; Pins: 2; Material: Ceramic; Case Code (Metric): 1608; Case Code (Imperial): 0603; Min Operating Temperature: -55°C; Max Operating Temperature: 125°C; Tolerance: 10%; Capacitance: 10nF; Dielectric: X7R; Voltage: 50V; Packaging: Tape and Reel; Voltage Rating: 50V; Voltage Rating (DC): 50V; Package Quantity: 1; Termination: SMD/SMT; Resistor Type: Ceramic; Series: CC; Length: 1.6mm; Width: 0.031inch; Height: 0.8mm; Thickness: 0.035inch; Depth: 0.8mm; Radiation Hardening: No; RoHS Compliant: Yes; Lead Free: Lead Free; Halogen Free: Halogen Free; ComponentLink1URL: C:\Users\Public\Documents\Altium\Projects\Cellar_Watchdog\Docs\Capacitor\UPY-GPHC_X7R_6.3V-to-250V_22.pdf; ComponentLink1Description: Datasheet; Supplier 2: Mouser; Supplier Part Number 1: 311-1085-1-ND; Supplier Part Number 2: 603-CC603KRX7R9BB103
C2 = CAP_0.1uF-50V-10%_0603: as C34 on sheet Voltage Supervisor; Supplier 1: Digi-Key; RoHS: Yes; Category: Ceramic Capacitors; Stock 1: 10054527; Pricing 1: 1=0.10000, 10=0.05400, 50=0.02960, 100=0.02430, 500=0.01732, 1000=0.01361 (USD); Mounting Technology: Surface Mount; Case/Package: 0603; Pins: 2; Case Code (Metric): 1608; Case Code (Imperial): 0603; Dielectric Material: Ceramic; Min Operating Temperature: -55°C; Max Operating Temperature: 125°C; Package Quantity: 1; Capacitance: 100nF; Voltage Rating: 50V; Tolerance: 10%; Packaging: Tape and Reel; Dielectric: X7R; Termination: SMD/SMT; Voltage: 50V; Series: CC; Length: 0.063inch; Width: 0.031inch; Height: 0.8mm; Thickness: 0.035inch; Depth: 0.8mm; Radiation Hardening: No; Reach SVHC Compliant: Yes; Lead Free: Lead Free; Halogen Free: Halogen Free; RoHS Compliant: Yes; ComponentLink1URL: C:\Users\Public\Documents\Altium\Projects\Cellar_Watchdog\Docs\Capacitor\UPY-GPHC_X7R_6.3V-to-250V_22.pdf; ComponentLink1Description: Datasheet; Supplier Part Number 2: 603-CC603KRX7R9BB104; Supplier Part Number 1: 311-1344-1-ND; Supplier 2: Mouser
C3 = CAP_4.7uF-25V-10%_0805: 4.7 µF ±10% 25V Ceramic Capacitor X7R 0805 (2012 Metric); Manufacturer: Yageo; Manufacturer Part Number: CC0805KKX7R8BB475; Supplier 1: Digi-Key; RoHS: Yes; Category: Ceramic Capacitors; Stock 1: 26099; Pricing 1: 1=0.39000, 10=0.27000, 50=0.18940, 100=0.16230, 500=0.12172, 1000=0.10278 (USD); Mounting Technology: Surface Mount; Case/Package: 0805; Case Code (Metric): 2012; Case Code (Imperial): 0805; Weight: 0.000194oz; Min Operating Temperature: -55°C; Max Operating Temperature: 125°C; Packaging: Tape and Reel; Capacitance: 4.7uF; Voltage Rating: 25V; Tolerance: 10%; Dielectric: X7R; Termination: SMD/SMT; Voltage Rating (DC): 25V; Package Quantity: 3000; Length: 0.079inch; Width: 0.049inch; Thickness: 0.057inch; Lead Free: Lead Free; Halogen Free: Halogen Free; RoHS Compliant: Yes; ComponentLink1URL: C:\Users\Public\Documents\Altium\Projects\Cellar_Watchdog\Docs\Capacitor\UPY-GP_NP0_16V-to-50V_18.pdf; ComponentLink1Description: Datasheet; Supplier 2: Mouser; Supplier Part Number 1: 311-1885-1-ND; Supplier Part Number 2: 603-CC805KKX7R8BB475
D1 = DIO-T-A-UNI_6V-14V-2.5A_10-USON: 14V Clamp 2.5A (8/20µs) Ipp Tvs Diode Surface Mount 10-USON (2.5x1); Manufacturer: Texas Instruments; Direction: Unidirectional; Working Voltage: 5.5V; Capacitance: 0.5pF; Number of Bidirectional Channels: 4; Min Breakdown Voltage: 6V; Peak Pulse Power: 40W; Power Line Protection: Yes; Leakage Current: 10nA; Interface: LVDS,USB,Ethernet,HDMI,PCIe,SATA; Supplier 1: Digi-Key; Manufacturer Part Number: TPD4E05U06DQAR; RoHS: Yes; Category: Integrated Circuits (ICs); Stock 1: 330722; Pricing 1: 1=0.73000, 10=0.64300, 100=0.49310, 500=0.38980, 1000=0.31184 (USD); Mount: Surface Mount; Case/Package: SON; Number of Pins: 10; Contact Plating: Gold; Min Operating Temperature: -40°C; Max Operating Temperature: 125°C; Clamping Voltage: 14V; Packaging: Tape and Reel; Package Quantity: 3000; Polarity: Unidirectional; Reverse Standoff Voltage: 5.5V; Number of Channels: 4; Breakdown Voltage: 6V; Max Power Dissipation: 40W; Termination: SMD/SMT; Operating Supply Voltage: 5.5V; Peak Pulse Current: 2.5A; Series: -; Number of Unidirectional Channels: 4; Length: 2.6mm; Depth: 1.1mm; Radiation Hardening: No; Reach SVHC Compliant: Yes; Lead Free: Lead Free; RoHS Compliant: Yes; ComponentLink1URL: C:\Users\Public\Documents\Altium\Projects\Cellar_Watchdog\Docs\Diode\tpd4e05u06.pdf; ComponentLink1Description: Datasheet; Supplier 2: Mouser; Supplier Part Number 2: 595-TPD4E05U06DQAR; Supplier Part Number 1: 296-35765-1-ND
FB1 = FB_26R-100MHz-6A_0603: 26 Ohms @ 100 MHz 1 Power Line Ferrite Bead 0603 (1608 Metric) 6A 7mOhm; Manufacturer: Murata; Manufacturer Part Number: BLM18SG260TZ1D; Supplier 1: Mouser; RoHS: Yes; Category: Ferrite Beads and Chips; Stock 1: 1330; Pricing 1: 1=0.14000, 10=0.11300, 50=0.11300, 100=0.06300, 1000=0.03800, 10000=0.03400 (USD); RoHS Compliant: Yes; ComponentLink1URL: C:\Users\Public\Documents\Altium\Projects\Cellar_Watchdog\Docs\Ferrite Bead\QNFA9122.pdf; ComponentLink1Description: Datasheet; Supplier Part Number 1: 81-BLM18SG260TZ1D; Impedance: 26R
FB2 = FB_22R-100MHz-500mA_0603: 22 Ohms @ 100 MHz 1 Signal Line Ferrite Bead 0603 (1608 Metric) 500mA 350mOhm; Manufacturer: Murata; Manufacturer Part Number: BLM18BA220SN1D; Material: Ferrite,Steel; Tolerance: 25%; Number of Lines: 1; DC Resistance (DCR): 350mR; Test Frequency: 100MHz; Shielding: Unshielded; Supplier 1: Digi-Key; RoHS: Yes; Category: Ferrite Beads and Chips; Stock 1: 75893; Pricing 1: 1=0.10000, 10=0.07600, 25=0.06800, 50=0.05000, 100=0.04320, 250=0.03408, 500=0.02878, 1000=0.02424 (USD); Case/Package: 0603; Pins: 2; Core Material: Ferrite; Case Code (Metric): 1608; Case Code (Imperial): 0603; Min Operating Temperature: -55°C; Max Operating Temperature: 125°C; Package Quantity: 1; Impedance: 22R; Packaging: Tape and Reel; Current Rating: 500mA; Max Current Rating: 500mA; Max DC Current: 500mA; Termination: SMD/SMT; DC Current: 500mA; Frequency: 100MHz; Number of Circuits: 1; Series: BLM18B; DC Resistance-Max: 350mR; Length: 1.6mm; Width: 0.8mm; Height: 0.8mm; Depth: 0.8mm; Radiation Hardening: No; Reach SVHC Compliant: Yes; Military Standard: Not; Lead Free: Lead Free; RoHS Compliant: Yes; ComponentLink1URL: C:\Users\Public\Documents\Altium\Projects\Cellar_Watchdog\Docs\Ferrite Bead\QNFA9122.pdf; ComponentLink1Description: Datasheet; Supplier 2: Mouser; Supplier Part Number 2: 81-BLM18BA220SN1D; Supplier Part Number 1: 490-1016-1-ND
J1 = CON-RCPT_USB2.0-Type-C_USB4105-GF-A: USB-C (USB TYPE-C) USB 2.0 Receptacle Connector 24 (16+8 Dummy) Position Surface Mount, Right Angle; Through Hole; Manufacturer: Global Connector Technology; ComponentLink2Description: Datasheet; ComponentLink2URL: C:\Users\Public\Documents\Altium\Projects\Cellar_Watchdog\Docs\Connector\usb4105.pdf; Supplier 1: Digi-Key; Manufacturer Part Number: USB4105-GF-A; RoHS: Yes; Category: USB Connectors; Stock 1: 73159; Pricing 1: 1=0.810000, 10=0.688000, 25=0.660000, 50=0.645800, 100=0.617700, 250=0.561560 (USD); Supplier 2: Mouser; Supplier Part Number 1: 2073-USB4105-GF-ACT-ND; Supplier Part Number 2: 640-USB4105-GF-A
R2 R3 = RES_5.1kR-100mW-1%_0603: 5.1 kOhms ±1% 0.1W, 1/10W Chip Resistor 0603 (1608 Metric) Moisture Resistant Thick Film; Manufacturer: Yageo; Manufacturer Part Number: RC0603FR-075K1L; Temperature Coefficient: 100ppm/°C; Max Power Dissipation: 100mW; Voltage Rating (DC): 50V; Supplier 1: Digi-Key; RoHS: Yes; Category: Chip SMD Resistors; Stock 1: 3842915; Pricing 1: 1=0.10000, 10=0.02100, 100=0.00850, 1000=0.00383, 2500=0.00332 (USD); Case/Package: 0603; Pins: 2; Case Code (Imperial): 0603; Case Code (Metric): 1608; Min Operating Temperature: -55°C; Max Operating Temperature: 155°C; Resistance: 5.1kR; Tolerance: 1%; Packaging: Tape and Reel; Number of Terminations: 2; Series: RC; Resistor Type: Thick Film; Power Rating: 100mW; Package Quantity: 1; Features: Moisture Resistant; Voltage Rating: 50V; Termination: SMD/SMT; Construction: Rectangular; Resistance Tolerance: 1%; Length: 0.063inch; Width: 0.031inch; Height: 0.022inch; Depth: 0.8mm; RoHS Compliant: Yes; Lead Free: Lead Free; Military Standard: Not; Reach SVHC Compliant: Yes; ComponentLink1URL: C:\Users\Public\Documents\Altium\Projects\Cellar_Watchdog\Docs\Resistor\PYu-RC_Group_51_RoHS_L_12.pdf; ComponentLink1Description: Datasheet; Supplier 2: Mouser; Supplier Part Number 1: 311-5.10KHRCT-ND; Supplier Part Number 2: 603-RC0603FR-075K1L
TP2-TP6 = Test Point: PCB Test Point; ClassName: Test Point
  TP2: Value: VBUS
  TP3: Value: USB_P
  TP4: Value: USB_N
  TP5: Value: CC1
  TP6: Value: CC2

## Sheet Main Power Switch.SchDoc: Main Power Switch
size A4; Date: Dec. 27th, 2022; Author: Karl Asseily; DrawnBy: Karl Asseily; DocumentNumber: 202301151913; Revision: 1.2; SheetNumber: 5; SheetTotal: 20
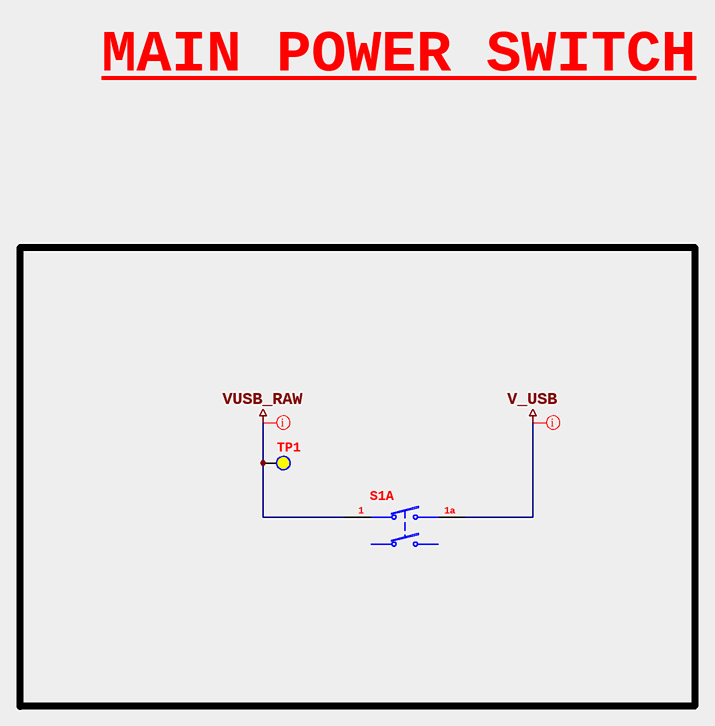
[diagram p12: Main Power Switch.SchDoc]

### Parts
S1  R1973BBLKBLKGR0  [SW_ROCKER-DPST_R1973BBLKBLKGR0]  (value not drawn)  (part A of 2)
TP1  VUSB_RAW  [TEST POINT HOLE]  (value not drawn)  (no BOM)

### Nets
V_USB: S1.1a
VUSB_RAW: S1.1 TP1.TP

### Layout directives
net class POWER; rule Supply Nets [Voltage = 5.000]: V_USB, VUSB_RAW

### Notes on the sheet
- MAIN POWER SWITCH
- Project
- Sheet
- Size
- Filename
- A4
- of
- Number
- Drawn By
- Rev.
- Variant
- Date

### Library data of the parts
S1 = SW4-ON-OFF-DPST_R1973BBLKBLKGR0_TH: Rocker Switch DPST 9A (AC) 125 V Panel Mount, Snap-In, Right Angle; Manufacturer: E-Switch; Mechanical Life: 30000Cycles; Voltage Rating (AC): 125V; Electrical Life: 10000Cycles; Switch Function: On-Off; Illumination Type: Illuminated; Supplier 1: Digi-Key; Manufacturer Part Number: R1973BBLKBLKGR0; RoHS: No; Category: Rocker Switches; Stock 1: 214; Pricing 1: 1=3.07000, 10=2.75300, 25=2.60040, 50=2.48640, 100=2.35950, 250=2.25804, 500=2.08044, 1000=1.97895 (USD); Mounting Technology: Panel,Snap in; Contact Plating: Silver; Min Operating Temperature: -30°C; Max Operating Temperature: 55°C; Package Quantity: 1; Current Rating: 9A; Packaging: Bulk; Termination: PC Pin; Throw Configuration: DPST; Series: R1973; Actuator Type: Rocker; RoHS Compliant: No; ComponentLink1URL: C:\Users\Public\Documents\Altium\Projects\Cellar_Watchdog\Docs\Switch\R1973.pdf; ComponentLink1Description: Datasheet; ComponentLink2Description: Drawing; ComponentLink2URL: C:\Users\Public\Documents\Altium\Projects\Cellar_Watchdog\Docs\Switch\M400001.pdf; Supplier Part Number 1: R1973BBLKBLKGR0-ND
TP1 = Test Point: PCB Test Point; Value: VUSB_RAW; ClassName: Test Point

## Sheet Voltage Regulators.SchDoc: Voltage Regulators
size A4; Date: Dec. 27th, 2022; Author: Karl Asseily; DrawnBy: Karl Asseily; DocumentNumber: 202301140903; Revision: 1.2; SheetNumber: 8; SheetTotal: 20
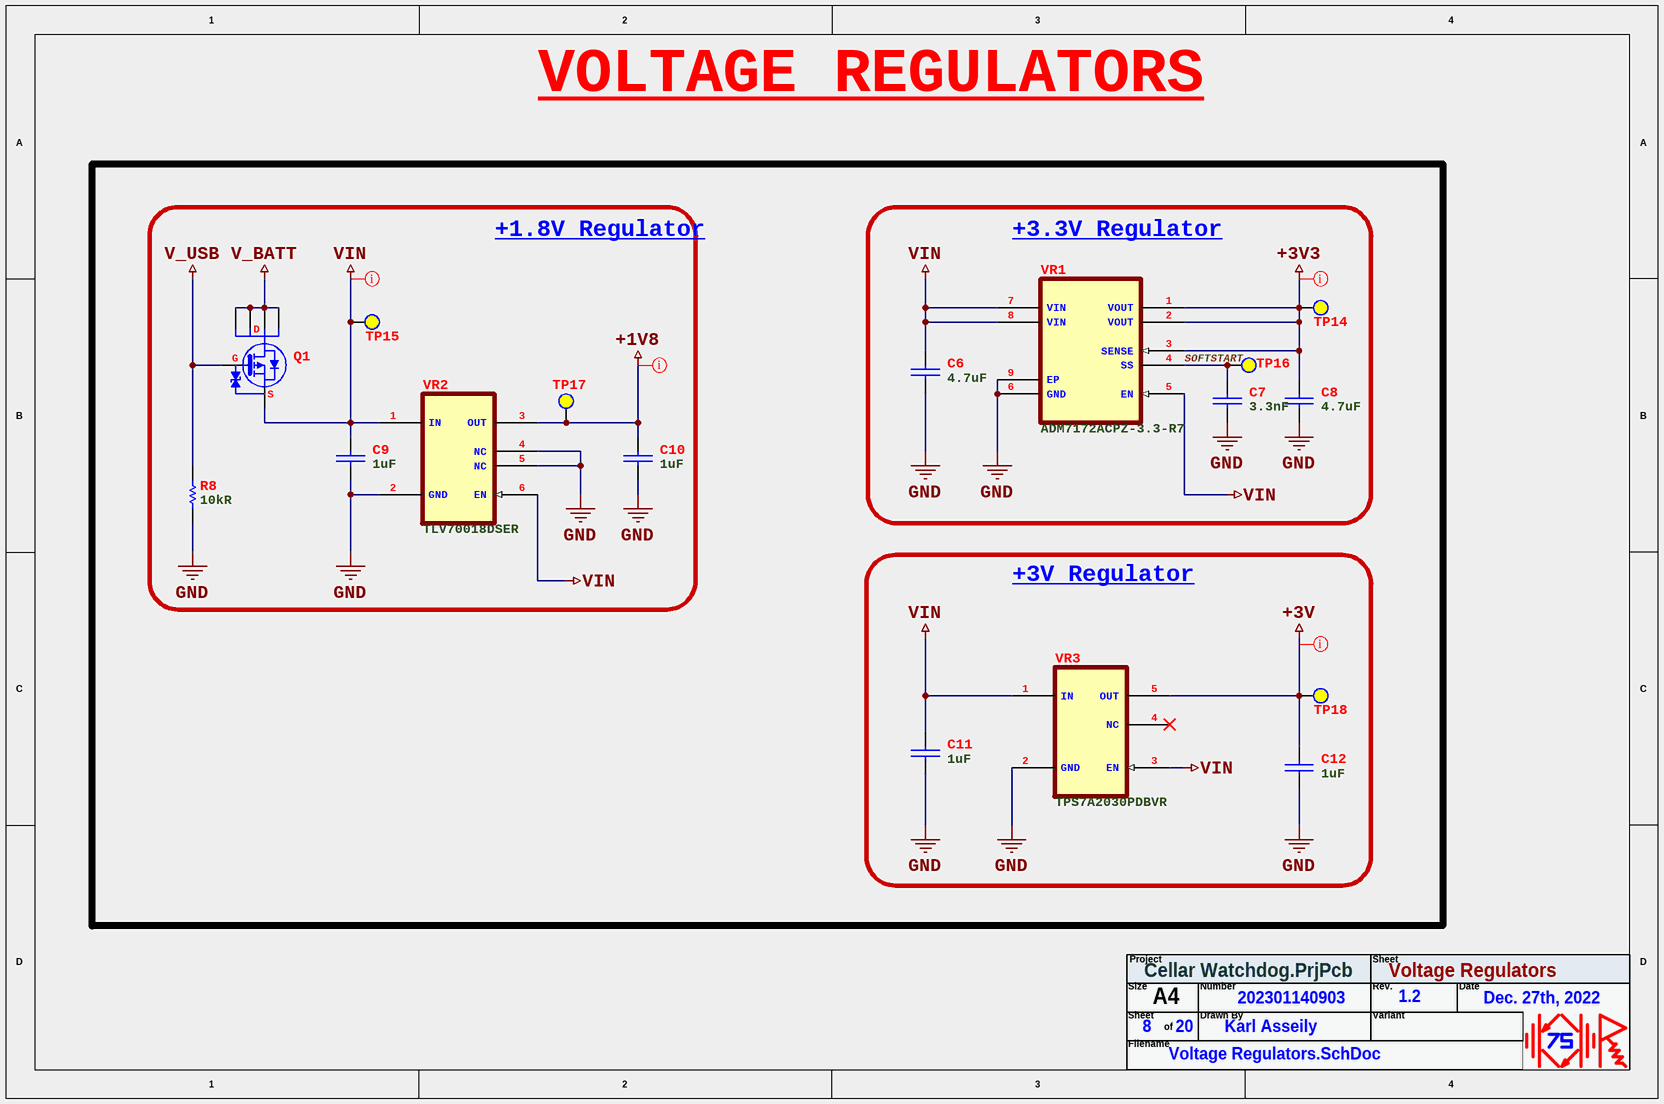
[diagram p13: Voltage Regulators.SchDoc]

### Parts
C6  4.7uF  [CAP_0805]
C7  3.3nF  [CAP_0603]
C8  4.7uF  [CAP_0805]
C9  1uF  [CAP_0805]
C10  1uF  [CAP_0805]
C11  1uF  [CAP_0805]
C12  1uF  [CAP_0805]
Q1  SSM6J412TU,LF  [MOS_SOTFL65P210X75-6N]  (value not drawn)
R8  10kR  [RES_0603]
TP14  +3V3  [TEST POINT PAD]  (value not drawn)  (no BOM)
TP15  VIN  [TEST POINT PAD]  (value not drawn)  (no BOM)
TP16  SOFTSTART  [TEST POINT HOLE]  (value not drawn)  (no BOM)
TP17  +1V8  [TEST POINT PAD]  (value not drawn)  (no BOM)
TP18  +3V  [TEST POINT PAD]  (value not drawn)  (no BOM)
VR1  ADM7172ACPZ-3.3-R7  [REG_SON50P300X300X80-9N]
VR2  TLV70018DSER  [REG_SON50P150X150X80-6N]
VR3  TPS7A2030PDBVR  [REG_SOT95P280X145-5N]

### Blocks framed on the sheet
+1.8V Regulator: C9 C10 Q1 R8 TP15 TP17 VR2
+3.3V Regulator: C6-C8 TP14 TP16 VR1
+3V Regulator: C11 C12 TP18 VR3

### Nets
+1V8: C10.1 TP17.TP VR2.3(OUT)
+3V: C12.1 TP18.TP VR3.5(OUT)
+3V3: C8.1 TP14.TP VR1.1(VOUT) VR1.2(VOUT) VR1.3(SENSE)
GND: C6.2 C7.2 C8.2 C9.2 C10.2 C11.2 C12.2 R8.2 VR1.6(GND) VR1.9(EP) VR2.2(GND) VR2.4(NC) VR2.5(NC) VR3.2(GND)
V_BATT: Q1.1(D) Q1.2(D) Q1.5(D) Q1.6(D)
V_USB: Q1.3(G) R8.1
VIN: C6.1 C9.1 C11.1 Q1.4(S) TP15.TP VR1.5(EN) VR1.7(VIN) VR1.8(VIN) VR2.1(IN) VR2.6(EN) VR3.1(IN) VR3.3(EN)
SOFTSTART: C7.1 TP16.TP VR1.4(SS)

Not connected (* = marked no-connect by the designer): VR3 4(NC)*

### Layout directives
net class POWER; rule Supply Nets [Voltage = 5.000]: VIN
net class POWER; rule Supply Nets [Voltage = 3.300]: +3V3
net class POWER; rule Supply Nets [Voltage = 1.800]: +1V8
net class POWER; rule Supply Nets [Voltage = 3.000]: +3V

### Notes on the sheet
- VOLTAGE REGULATORS
- (near Q1) D
- (near Q1) G
- (near Q1) S
- Project
- Sheet
- Size
- Filename
- A4
- of
- Number
- Drawn By
- Rev.
- Variant
- Date

### Library data of the parts
C6 C8 = CAP_4.7uF-25V-10%_0805: as C3 on sheet USB-C Connector; Supplier 1: Digi-Key; RoHS: Yes; Category: Ceramic Capacitors; Stock 1: 26099; Pricing 1: 1=0.39000, 10=0.27000, 50=0.18940, 100=0.16230, 500=0.12172, 1000=0.10278 (USD); Mounting Technology: Surface Mount; Case/Package: 0805; Case Code (Metric): 2012; Case Code (Imperial): 0805; Weight: 0.000194oz; Min Operating Temperature: -55°C; Max Operating Temperature: 125°C; Packaging: Tape and Reel; Capacitance: 4.7uF; Voltage Rating: 25V; Tolerance: 10%; Dielectric: X7R; Termination: SMD/SMT; Voltage Rating (DC): 25V; Package Quantity: 3000; Length: 0.079inch; Width: 0.049inch; Thickness: 0.057inch; Lead Free: Lead Free; Halogen Free: Halogen Free; RoHS Compliant: Yes; ComponentLink1URL: C:\Users\Public\Documents\Altium\Projects\Cellar_Watchdog\Docs\Capacitor\UPY-GP_NP0_16V-to-50V_18.pdf; ComponentLink1Description: Datasheet; Supplier 2: Mouser; Supplier Part Number 1: 311-1885-1-ND; Supplier Part Number 2: 603-CC805KKX7R8BB475
C7 = CAP_3.3nF-50V-10%_0603: 3300 pF ±10% 50V Ceramic Capacitor X7R 0603 (1608 Metric); Manufacturer: Yageo; Manufacturer Part Number: CC0603KRX7R9BB332; Dissipation Factor: 3%; Insulation Resistance: 100GR; Supplier 1: Digi-Key; RoHS: Yes; Category: Ceramic Capacitors; Stock 1: 541031; Pricing 1: 1=0.10000, 10=0.04600, 50=0.02480, 100=0.02030, 500=0.01450, 1000=0.01139 (USD); Mounting Technology: Surface Mount; Case/Package: 0603; Pins: 2; Case Code (Imperial): 0603; Case Code (Metric): 1608; Dielectric Material: Ceramic; Min Operating Temperature: -55°C; Max Operating Temperature: 125°C; Tolerance: 10%; Capacitance: 3.3nF; Dielectric: X7R; Package Quantity: 1; Voltage Rating: 50V; Voltage Rating (DC): 50V; Packaging: Tape and Reel; Termination: SMD/SMT; Resistor Type: Ceramic; Voltage: 50V; Series: CC; Length: 1.6mm; Width: 0.031inch; Height: 0.8mm; Thickness: 0.035inch; Depth: 0.8mm; Radiation Hardening: No; RoHS Compliant: Yes; Reach SVHC Compliant: Yes; Lead Free: Lead Free; Halogen Free: Halogen Free; ComponentLink1URL: C:\Users\Public\Documents\Altium\Projects\Cellar_Watchdog\Docs\Capacitor\UPY-GPHC_X7R_6.3V-to-250V_22.pdf; ComponentLink1Description: Datasheet; Supplier 2: Mouser; Supplier Part Number 1: 311-1082-1-ND; Supplier Part Number 2: 603-CC603KRX7R9BB332
C9-C12 = CAP_1uF-16V-10%_0603: as C35 on sheet Voltage Supervisor; Supplier 1: Digi-Key; RoHS: Yes; Category: Ceramic Capacitors; Stock 1: 10491943; Pricing 1: 1=0.14000, 10=0.09800, 50=0.05560, 100=0.04610, 500=0.03234, 1000=0.02678 (USD); Mounting Technology: Surface Mount; Case/Package: 0603; Pins: 2; Case Code (Metric): 1608; Case Code (Imperial): 0603; Min Operating Temperature: -55°C; Max Operating Temperature: 125°C; Capacitance: 1uF; Tolerance: 10%; Dielectric: X7R; Voltage Rating: 16V; Package Quantity: 1; Packaging: Tape and Reel; Voltage Rating (DC): 16V; Termination: SMD/SMT; Resistor Type: Ceramic; Voltage: 16V; Series: CC; Construction: Flat; Length: 1.6mm; Width: 0.031inch; Height: 0.8mm; Thickness: 0.035inch; Depth: 0.8mm; Radiation Hardening: No; Lead Free: Lead Free; Halogen Free: Halogen Free; RoHS Compliant: Yes; ComponentLink1URL: C:\Users\Public\Documents\Altium\Projects\Cellar_Watchdog\Docs\Capacitor\UPY-GPHC_X7R_6.3V-to-250V_22.pdf; ComponentLink1Description: Datasheet; Supplier 2: Mouser; Supplier Part Number 1: 311-1446-1-ND; Supplier Part Number 2: 603-CC603KRX7R7BB105
Q1 = MOS-P_20V-4A-42.7mR_6-UF: P-Channel 20 V 4A (Ta) 1W (Ta) Surface Mount UF6; Manufacturer: Toshiba; Supplier 1: Digi-Key; Manufacturer Part Number: SSM6J412TU,LF; RoHS: No; Category: Uncategorized; Stock 1: 8000; Pricing 1: 1=0.37000, 10=0.29600, 100=0.20160, 500=0.15120, 1000=0.11340 (USD); Supplier 2: Mouser; Supplier Part Number 1: SSM6J412TULFCT-ND; Supplier Part Number 2: 757-SSM6J412TU,LF; ComponentLink1Description: Datasheet; ComponentLink1URL: C:\Users\Public\Documents\Altium\Projects\Cellar_Watchdog\Docs\MOSFET\SSM6J412TU_datasheet_en_20140301.pdf
R8 = RES_10kR-100mW-1%_0603: as R28 on sheet Voltage Supervisor; Supplier 1: Digi-Key; RoHS: Yes; Category: Chip SMD Resistors; Stock 1: 43209622; Pricing 1: 1=0.10000, 10=0.02100, 100=0.00850, 1000=0.00383, 2500=0.00332 (USD); Case/Package: 0603; Pins: 2; Case Code (Imperial): 0603; Case Code (Metric): 1608; Weight: 7.1E-05oz; Min Operating Temperature: -55°C; Max Operating Temperature: 155°C; Tolerance: 1%; Resistor Type: Thick Film; Resistance: 10kR; Packaging: Tape and Reel; Termination: SMD/SMT; Features: Moisture Resistant; Series: RC; Max Power Dissipation: 100mW; Number of Terminations: 2; Resistance Tolerance: 1%; Construction: Rectangular; Length: 1.6mm; Width: 0.8mm; Height: 0.45mm; Depth: 0.8mm; Lead Pitch: 0.3mm; Reach SVHC Compliant: Yes; Lead Free: Lead Free; Military Standard: Not; RoHS Compliant: Yes; ComponentLink6URL: C:\Users\Public\Documents\Altium\Projects\Cellar_Watchdog\Docs\Resistor\PYu-RC_Group_51_RoHS_L_12.pdf; ComponentLink6Description: Datasheet; Supplier 2: Mouser; Supplier Part Number 1: 311-10.0KHRCT-ND; Supplier Part Number 2: 603-RC0603FR-0710KL
TP14-TP18 = Test Point: PCB Test Point; ClassName: Test Point
  TP14: Value: +3V3
  TP15: Value: VIN
  TP16: Value: SOFTSTART
  TP17: Value: +1V8
  TP18: Value: +3V
VR1 = REG_3.3V-2A_8-LFCSP-WD: Linear Voltage Regulator IC Positive Fixed 1 Output 2A 8-LFCSP-WD (3x3); Manufacturer: Analog Devices; Output Voltage: 3.3V; Dropout Voltage: 172mV; Number of Regulators: 1; Min Current Limit: 2.4A; Quiescent Current: 700uA; Max Input Voltage: 6.5V; Min Input Voltage: 2.3V; Supplier 1: Digi-Key; Manufacturer Part Number: ADM7172ACPZ-3.3-R7; RoHS: Yes; Category: Voltage Regulators - Linear; Stock 1: 4322; Pricing 1: 1=6.80000, 10=6.10500, 25=5.77160, 100=5.00210, 250=4.74560, 500=4.25824 (USD); Mount: Surface Mount; Number of Pins: 8; Min Operating Temperature: -40°C; Max Operating Temperature: 125°C; Packaging: Tape and Reel; Output Current: 2A; Package Quantity: 1500; Polarity: Positive; Max Output Current: 2A; Number of Outputs: 1; Output Type: Fixed; Lead Free: Contains Lead; RoHS Compliant: Yes; ComponentLink2URL: C:\Users\Public\Documents\Altium\Projects\Cellar_Watchdog\Docs\Voltage Regulator\ADM7172.pdf; ComponentLink2Description: Datasheet; Supplier 2: Mouser; Supplier Part Number 1: 505-ADM7172ACPZ-3.3-R7CT-ND; Supplier Part Number 2: 584-ADM7172ACPZ3.3R7
VR2 = REG_1.8V-200mA_6-WSON: Linear Voltage Regulator IC Positive Fixed 1 Output 200mA 6-WSON (1.5x1.5); Manufacturer: Texas Instruments; Output Voltage: 1.8V; Dropout Voltage: 175mV; Number of Outputs: 1; Max Power Dissipation: 555mW; Max Input Voltage: 5.5V; Min Input Voltage: 2V; Min Current Limit: 220mA; Output Voltage Accuracy: 2%; Quiescent Current: 30uA; Supplier 1: Digi-Key; Manufacturer Part Number: TLV70018DSER; RoHS: Yes; Category: Voltage Regulators - Linear; Stock 1: 24574; Pricing 1: 1=0.55000, 10=0.46900, 25=0.43760, 100=0.35020, 250=0.32520, 500=0.27518, 1000=0.21264 (USD); Case/Package: WFDFN; Number of Pins: 6; Min Operating Temperature: -40°C; Max Operating Temperature: 125°C; Packaging: Tape and Reel; Output Current: 200mA; Package Quantity: 3000; Max Output Current: 200mA; Number of Regulators: 1; Polarity: Positive; Power Dissipation: 555mW; Accuracy: 2%; Max Output Voltage: 1.8V; Min Output Voltage: 1.8V; Output Type: Fixed; Series: -; Lead Free: Lead Free; RoHS Compliant: Yes; ComponentLink2URL: C:\Users\Public\Documents\Altium\Projects\Cellar_Watchdog\Docs\Voltage Regulator\tlv700.pdf; ComponentLink2Description: Datasheet; Supplier 2: Mouser; Supplier Part Number 1: 296-39277-1-ND; Supplier Part Number 2: 595-TLV70018DSER
VR3 = REG_3V-300mA_SOT-23-5: Linear Voltage Regulator IC Positive Fixed 1 Output 300mA SOT-23-5; Manufacturer: Texas Instruments; Supplier 1: Digi-Key; Manufacturer Part Number: TPS7A2030PDBVR; RoHS: Yes; Category: Voltage Regulators - Linear; Stock 1: 34133; Pricing 1: 1=0.49000, 10=0.41700, 25=0.38960, 100=0.31160, 250=0.28936, 500=0.24486, 1000=0.18921 (USD); RoHS Compliant: Yes; Supplier 2: Mouser; ComponentLink1Description: Datasheet; ComponentLink1URL: C:\Users\Public\Documents\Altium\Projects\Cellar_Watchdog\Docs\Voltage Regulator\tps7a20.pdf; Supplier Part Number 1: 296-TPS7A2030PDBVRCT-ND; Supplier Part Number 2: 595-TPS7A2030PDBVR